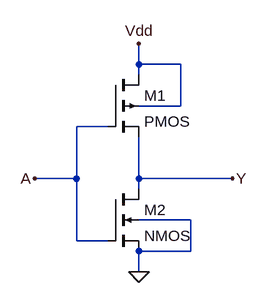
[diagram p0: schematic NOT1.asc]
NOT1.asc, the LTspice schematic file:
Version 4
SHEET 1 880 680
WIRE 224 16 224 -16
WIRE 288 16 224 16
WIRE 224 32 224 16
WIRE 288 80 288 16
WIRE 288 80 224 80
WIRE 176 112 128 112
WIRE 128 192 128 112
WIRE 128 192 64 192
WIRE 224 192 224 128
WIRE 368 192 224 192
WIRE 224 208 224 192
WIRE 304 256 224 256
WIRE 128 288 128 192
WIRE 176 288 128 288
WIRE 304 304 304 256
WIRE 304 304 224 304
WIRE 224 336 224 304
FLAG 224 336 0
FLAG 224 -16 Vdd
FLAG 64 192 A
FLAG 368 192 Y
SYMBOL pmos4 176 32 R0
SYMATTR InstName M1
SYMBOL nmos4 176 208 R0
SYMATTR InstName M2

The netlist it stands for:
* NOT1.asc
M1 Vdd A Y Vdd PMOS
M2 Y A 0 0 NMOS
.model NMOS NMOS
.model PMOS PMOS
.lib standard.mos
.backanno
.end